# EAGLE design Mini-Lora (EAGLE 7.7.0)
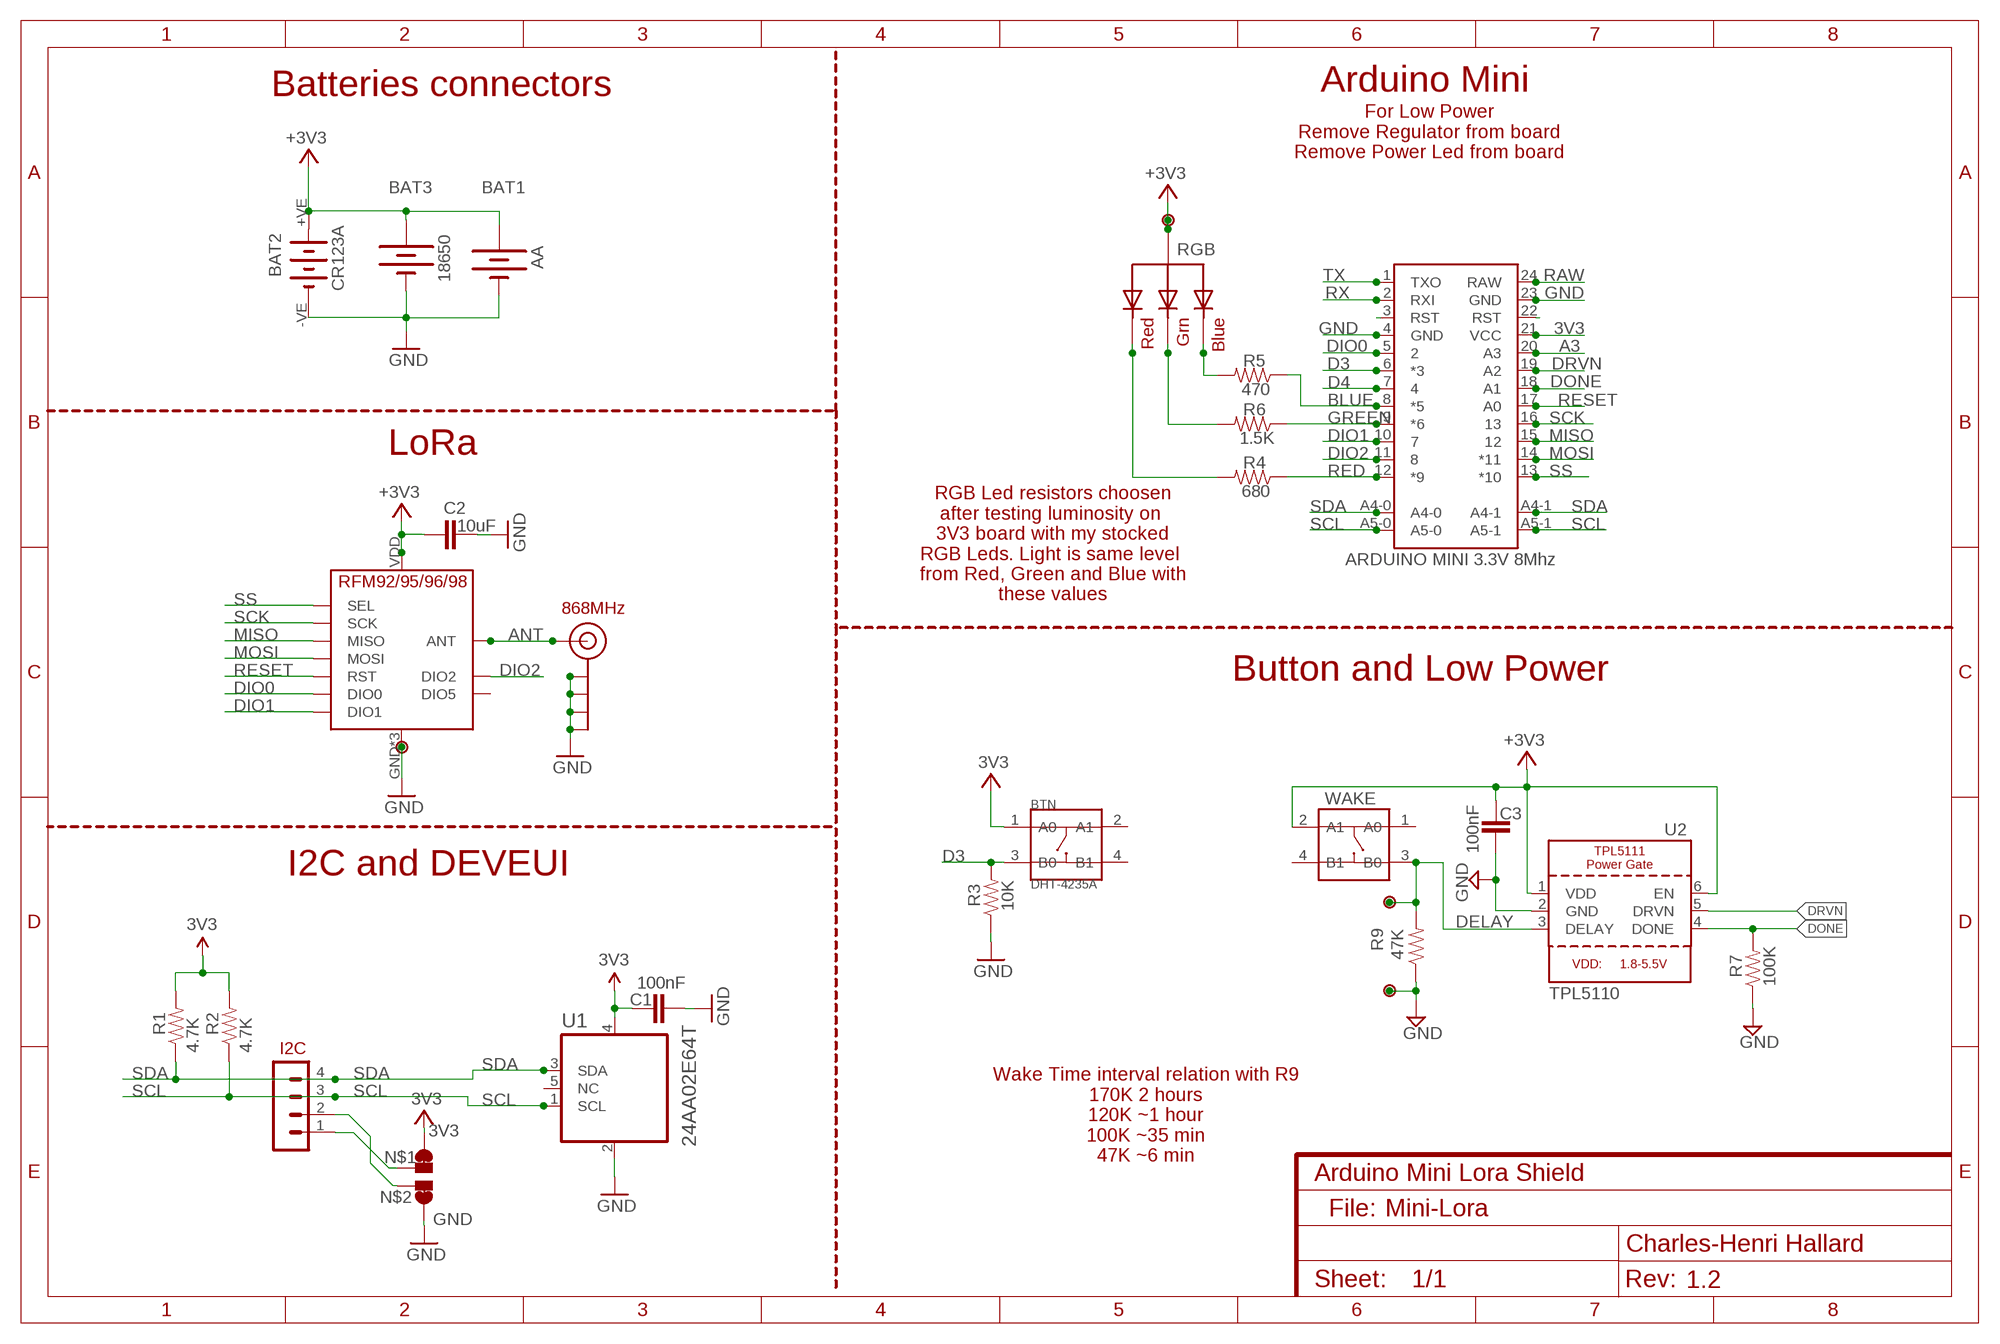
[diagram p0: schematic, sheet 1]
NAME (FRAME-A4L): CNAME: Arduino Mini Lora Shield; CREVISION: 1.2; DESIGNER: Charles-Henri Hallard

## Parts
BAT1  AA  BATTERYAA  [BATTERY-AA]
BAT2  CR123A  BATT-CR123A  [KEYSTONE-2/3A]
BAT3  18650  BATTERY18650  [BATTERY_18650-HOLDER]
BTN  DHT-4235A  SMD-BUTTON-TOP-DHT-4235A(4P-4.2X3.2MM)  [SW4-SMD-4.2X3.2X2.5MM]
C1  100nF  CAP0805-CAP  [0805-CAP]
C2  10uF  CAP0805-CAP-LARGEPADS  [0805-CAP-LARGEPADS]
C3  100nF  CAP0805-CAP  [0805-CAP]
I2C  CON_HEADER_1X04'NO_LOCK'  [1X04_NO_LOCK]
J$2  ANTENNATINY  [SMA_UFL_PAD_TINY]
P1  GND  PADNORMAL  [PAD]
P2  PADNORMAL  [PAD]
P3  PADNORMAL  [PAD]
P4  PADNORMAL  [PAD]
R1  4.7K  RESISTOR0805-RES  [0805-RES]
R2  4.7K  RESISTOR0805-RES  [0805-RES]
R3  10K  RESISTOR0805-RES  [0805-RES]
R4  680  RESISTOR0805-RES  [0805-RES]
R5  470  RESISTOR0805-RES  [0805-RES]
R6  1.5K  RESISTOR0805-RES  [0805-RES]
R7  100K  RESISTOR0805-RES  [0805-RES]
R9  47K  RESISTOR'1206-RES''  [1206-RES]
RGB  RGBLED  RGBLED_CASTRAIGHT  [LED5MMRGB_ST]
U1  24AA02E64T  24AA02E64T-I/OT  [SOT95P270X145-5N]
U2  TPL5110  TPL5111  [SOT23-6]
U$1  PAD-JUMPER-SWAPSWAP  [PAD-JUMPER-SWAP]
U$5  RFM95  [RFM95]
U$6  ARDUINO MINI 3.3V 8Mhz  ARDUINO_PRO_MINI  [ARDUINO_PRO_MINI]
WAKE  WAKE  SMD-BUTTON-TOP-DHT-4235A(4P-4.2X3.2MM)  [SW4-SMD-4.2X3.2X2.5MM]

## Nets
3V3: BAT1.PWR@1(+) BAT2.+VE(+) BAT3.PWR@1(+) BTN.1(A0) C1.1 C2.2 C3.1 P4.1 R1.2 R2.2 RGB.2(VCC) U1.4(VCC) U2.1(VDD) U2.6(EN) U$1.4 U$1.44 U$5.VDD(VCC) U$6.21(VCC) WAKE.2(A1) ; supply symbol labelled +3V3
A3: U$6.20(A3)
ANT: J$2.ANT1(SIGNAL) J$2.ANT2(SIGNAL) J$2.ANT3(SIGNAL) U$5.ANT
BLUE: R5.1 U$6.8(*5)
D3: BTN.3(B0) R3.2 U$6.6(*3)
D4: U$6.7
DELAY: P2.1 R9.2 U2.3(DELAY) WAKE.3(B0)
DIO0: U$5.DIO0 U$6.5
DIO1: U$5.DIO1 U$6.10
DIO2: U$5.DIO2 U$6.11
DONE: R7.2 U2.4(DONE) U$6.18(A1)
DRVN: U2.5(DRVN) U$6.19(A2)
GND: BAT1.GND@1(-) BAT2.-VE(-) BAT3.GND@1(-) C1.2 C2.1 C3.2 J$2.GND1(GND) J$2.GND2(GND) J$2.GND3(GND) J$2.GND4(GND) P1.1 P3.1 R3.1 R7.1 R9.1 U1.2(VSS) U2.2(GND) U$1.1 U$1.11 U$5.GND U$5.GND1(GND) U$5.GND2(GND) U$6.4(GND) U$6.23(GND)
GREEN: R6.1 U$6.9(*6)
LB: R5.2 RGB.4(BLUE)
LG: R6.2 RGB.3(GREEN)
LR: R4.2 RGB.1(RED)
MISO: U$5.MISO U$6.15
MOSI: U$5.MOSI U$6.14(*11)
N$1: I2C.1 U$1.3
N$2: I2C.2 U$1.2
N$3: U$6.3(RST)
RAW: U$6.24(RAW)
RED: R4.1 U$6.12(*9)
RESET: U$5.RST U$6.17(A0)
RST: U$6.22(RST)
RX: U$6.2(RXI)
SCK: U$5.SCK U$6.16
SCL: I2C.3 R2.1 U1.1(SCL) U$6.A5-0 U$6.A5-1
SDA: I2C.4 R1.1 U1.3(SDA) U$6.A4-0 U$6.A4-1
SS: U$5.NSS(SEL) U$6.13(*10)
TX: U$6.1(TXO)
Unconnected: BTN.2(A1) BTN.4(B1) U1.5(NC) U$5.DIO5 WAKE.1(A0) WAKE.4(B1)

## Notes on the sheet
- Batteries connectors | Arduino Mini
- For Low Power
  Remove Regulator from board
  Remove Power Led from board
- LoRa
- RGB Led resistors choosen
  after testing luminosity on 
  3V3 board with my stocked
  RGB Leds. Light is same level 
  from Red, Green and Blue with
  these values
- 868MHz
- Button and Low Power
- I2C and DEVEUI
- Wake Time interval relation with R9
  170K 2 hours
  120K ~1 hour
  100K ~35 min
  47K ~6 min
- File:

## Library data of the parts
BAT1 = JeeLabs.rpt:BATTERY: Battery Holders
BAT2 = edeca.net-v5:BATT-CR123A: CR123A (2/3rd AA) battery holder Manufacturer: Keystone Mouser part: 534-1019
BAT3 = _c2h:BATTERY: Battery Holders
BTN = Switch-2016:SMD-BUTTON-TOP-DHT-4235A(4P-4.2X3.2MM): 311020045; MPN: DHT-4235A
C1-C3 = _c2h:CAP: Capacitor Standard 0603 ceramic capacitor, and 0.1" leaded capacitor.
I2C = _c2h:CON_HEADER_1X04
J$2 = _c2h:ANTENNA: SMA Antenna Connector End launch SMA connector. The paste layer has been removed so that the connector can be hand soldered onto the board after reflow.
P1 P4 = _c2h:PAD
P2 P3 = _c2h-MacBook Pro de Charles-Henri:PAD
R1-R7 R9 = _c2h:RESISTOR: Resistor Basic schematic elements and footprints for 0603, 1206, and PTH resistors.
RGB = _c2h:RGBLED_CA: RGB LED, common-anode 5MM Staggered pins 5mm Piranha package http://www.ladyada.net/library/pcb/eaglelibrary.html
U1 = Microchip-24AA02E64T:24AA02E64T-I/OT: 2K I2C™ Serial EEPROMs, SOT23-5; MPN: 24AA02E64T-I/OT; OC_FARNELL: 2345567; OC_NEWARK: 01X0461; PACKAGE: SOT23-5; SUPPLIER: Microchip
U2 = microbuilder:TPL5111: TPL5111 Timer Based Power Gate Selectable Time Intervals: 100 ms to 7200 s Current Consumption at 2.5 V: 35 nA (typical) Supply Voltage Range: 1.8 V to 5.5 V
U$1 = _c2h:PAD-JUMPER-SWAP
U$5 = _c2h:RFM95
U$6 = _c2h:ARDUINO_PRO_MINI
WAKE = Switch-2016:SMD-BUTTON-TOP-DHT-4235A(4P-4.2X3.2MM): 311020045; MPN: DHT-4235A; VALUE: DHT-4235A

## Net classes
0 default: width 0.203 mm, drill 0.356 mm, clearance 0.152 mm
1 power: width 0.203 mm, clearance 0.152 mm
2 GND: width 0.203 mm, drill 0.305 mm, clearance 0.152 mm

## Board
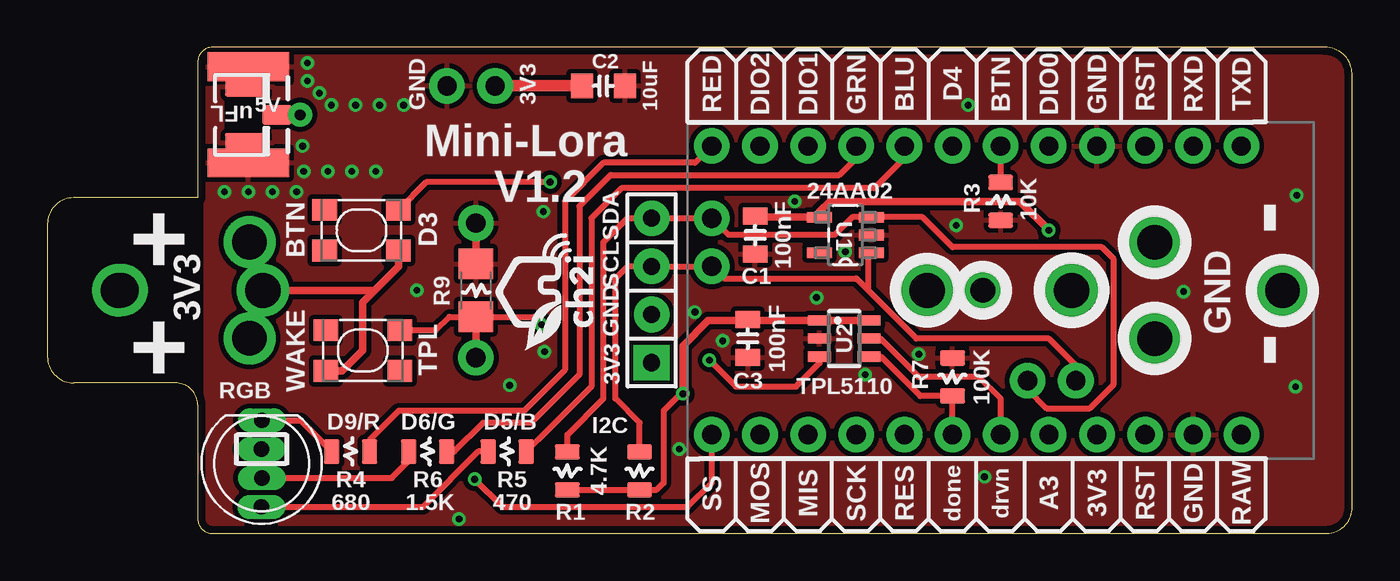
[diagram p1: board, top side]
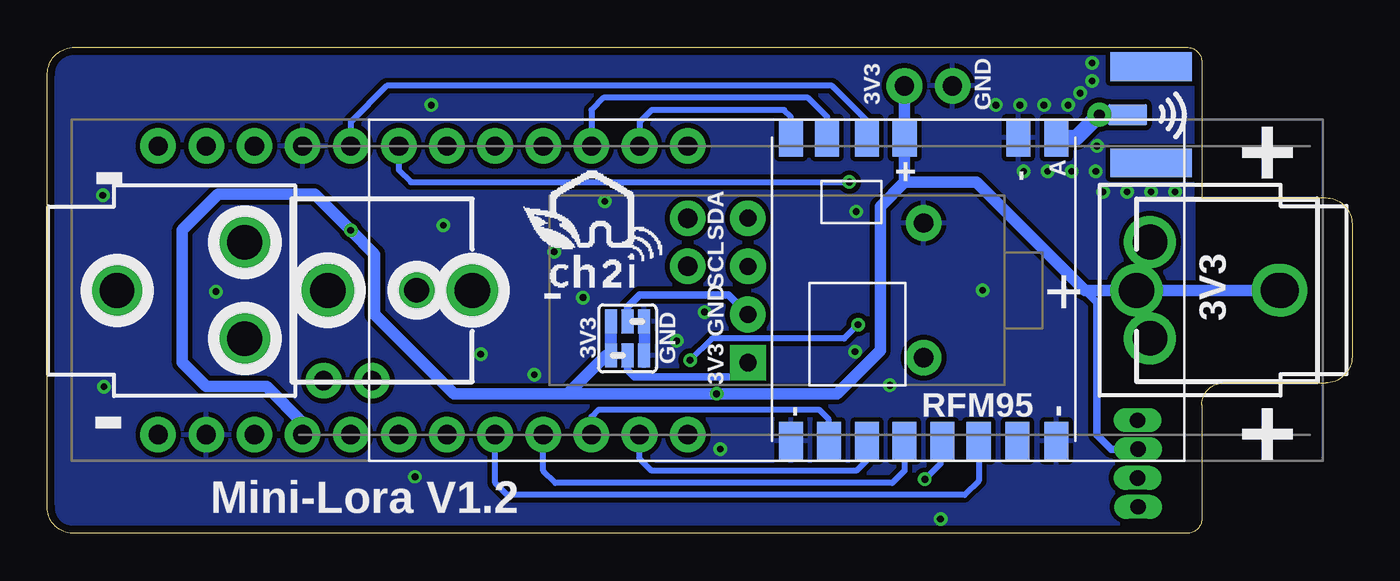
[diagram p2: board, bottom side, seen from below]

Size 68.83 x 25.65 mm. Coordinates in mm from the lower left corner, seen from the top.
Outline: 67.41,25.65 8.7,25.65 arc90 7.94,24.89 7.94,17.72 1.4,17.72 arc90 0,16.32 0,9.33 arc90 1.4,7.94 6.73,7.94 arc-90 7.94,6.79 7.94,0.76 arc90 8.7,0 67.5,0 arc90 68.83,1.4 68.83,24.26 arc90 67.41,25.65
Copper layers (1*16): Top 0.0356mm / dielectric 1.5011mm / Bottom 0.0356mm
Design rules "PCBs_io": minimum track width 6mil, minimum drill 13mil, track to track 6mil, track to pad 6mil, pad to pad 6mil, via to via 6mil, smd to smd 6mil, copper to edge 15mil, drill to drill 6mil, minimum pad ring 7mil, minimum via ring 7mil, stop-mask expansion 3mil, vias tented up to drill 40mil, thermal gap 10mil

### Footprints (pad centres in the part's own frame; a part is rotated, then mirrored left to right if it is on the bottom)
BATTERY-AA = drill 1.854: GND@1 25.146,0; GND@2 17.526,0; PWR@1 -25.146,0; PWR@2 -17.526,0
KEYSTONE-2/3A = drill 1.3: +VE 0,19; -VE 0,-19
BATTERY_18650-HOLDER = drill 1.829: GND@1 30.628,0.01; GND@2 23.88,2.55; GND@3 23.88,-2.53; PWR@1 -30.628,-0.01; PWR@2 -23.88,2.53; PWR@3 -23.88,-2.55
SW4-SMD-4.2X3.2X2.5MM = smd 1.3 x 1.15: 1 -1.95,1.075; 2 1.95,1.075; 3 -1.95,-1.075; 4 1.95,-1.075
0805-CAP = smd 0.902 x 1.3: 1 -1,0; 2 1,0
0805-CAP-LARGEPADS = smd 1.156 x 1.3: 1 -1.127,0; 2 1.127,0
1X04_NO_LOCK = drill 0.9 pad 1.88 square: 1 -3.816,-0.121 | drill 0.9 pad 1.88: 2 -1.27,-0.133; 3 1.27,-0.121; 4 3.81,-0.133
SMA_UFL_PAD_TINY = smd 1.524 x 1.016: ANT1 -3.843,0 | drill 0.559 pad 1.27: ANT2 -5.08,0 | smd 2.032 x 1.143 bottom: ANT3 -3.589,0 | smd 2.2 x 1.016: GND1 -2.223,1.47; GND2 -2.223,-1.47 | smd 4.318 x 1.524: GND3 -2.349,-2.54; GND4 -2.349,2.54 | smd 4.318 x 1.524 bottom: GND5 -2.349,2.54; GND6 -2.349,-2.54
PAD = drill 1.016 pad 1.88: 1 0,0
0805-RES = smd 0.8 x 1.3: 1 -1,0; 2 1,0
1206-RES = smd 1.6 x 1.8: 1 -1.4,0; 2 1.4,0
LED5MMRGB_ST = drill 0.8 pad 1.27 long: 1 -2.286,0.016; 2 -0.762,-0.016; 3 0.762,0.016; 4 2.286,-0.016
SOT95P270X145-5N = smd 1.321 x 0.559: 1 -1.372,0.94; 2 -1.372,0; 3 -1.372,-0.94; 4 1.372,-0.94; 5 1.372,0.94
SOT23-6 = smd 0.55 x 1.2: 1 -0.95,-1.3; 2 0,-1.3; 3 0.95,-1.3; 4 0.95,1.3; 5 0,1.3; 6 -0.95,1.3
PAD-JUMPER-SWAP = smd 0.635 x 1.27: 1 -0.876,0.889; 2 0,-0.889; 3 0,0.889; 4 0.876,-0.889; 11 -0.876,-0.889; 44 0.876,0.889
RFM95 = smd 2 x 1.27: ANT 5.777,-7; DIO0 5.777,3; DIO1 5.779,5.095; DIO2 5.779,7; DIO5 -10.225,-4.936; GND 5.777,-5; GND1 -10.223,7; GND2 -10.23,-7; MISO -10.23,5; MOSI -10.225,3; NSS -10.223,-1; RST -10.223,-2.905; SCK -10.23,1.012; VDD 5.777,1
ARDUINO_PRO_MINI = drill 1.016 pad 1.88: 1 -7.62,12.7; 2 -7.62,10.16; 3 -7.62,7.62; 4 -7.62,5.08; 5 -7.62,2.54; 6 -7.62,0; 7 -7.62,-2.54; 8 -7.62,-5.08; 9 -7.62,-7.62; 10 -7.62,-10.16; 11 -7.62,-12.7; 12 -7.62,-15.24; 13 7.62,-15.24; 14 7.62,-12.7; 15 7.62,-10.16; 16 7.62,-7.62; 17 7.62,-5.08; 18 7.62,-2.54; 19 7.62,0; 20 7.62,2.54; 21 7.62,5.08; 22 7.62,7.62; 23 7.62,10.16; 24 7.62,12.7; A4-0 -3.81,-15.24; A4-1 4.763,1.429; A5-0 -1.27,-15.24; A5-1 4.763,3.969

### Placement (x,y rotation side)
BAT1  28.89,12.83 180 bottom
BAT2  30.35,12.83 270 bottom
BAT3  34.54,12.83 180 bottom
BTN  16.57,16 180 top
C1  37.34,15.75 270 top
C2  29.34,23.62 180 top
C3  36.96,10.29 270 top
I2C  31.75,12.83 90 top
J$2  8.25,22.1 180 top
P1  21.08,23.62 0 top
P2  22.61,9.27 0 top
P3  22.61,16.38 0 top
P4  23.62,23.62 0 top
R1  27.43,3.3 270 top
R2  31.24,3.3 270 top
R3  50.29,17.53 90 top
R4  16,4.32 180 top
R5  24.26,4.32 180 top
R6  20.07,4.32 180 top
R7  47.75,8.26 270 top
R9  22.61,12.83 270 top
RGB  11.3,3.68 270 top
U1  42.1,15.75 180 top
U2  42.04,10.29 270 top
U$1  38.23,10.29 180 bottom
U$2  [LOGO_C2I_015]  28.83,9.65 90 top
U$4  [LOGO_CH2I_75MM]  39.62,14.99 0 bottom
U$5  22.61,15.11 90 bottom
U$6  50.29,12.83 270 top
WAKE  16.64,9.65 180 top

### Tracks (layer width: path | path; a pad name or v marks a point on that pad's centre or on a via)
3V3  (via drill 0.36 pad 0.71)
  Top 0.305: R1.2 R2.2 32.15,2.3 32.51,2.67 32.51,6.48 33.4,7.37
  Top 0.406: 37.64,11.24 U2.1 U2.6 | 37.64,11.24 C3.1 | 37.64,11.24 34.86,11.24 33.53,9.91 v33.53,7.37 33.4,7.37 | v52.83,16 51.31,17.53 41.27,17.53 40.73,16.98 U1.4 37.4,16.69 C1.1 | WAKE.2 15.56,8.58 16.64,9.65 16.64,12.19 17.27,12.83 | BTN.1 18.52,14.08 17.27,12.83 | 17.27,12.83 BAT2.+VE
  Top 0.61: C2.2 P4.1
  Bottom 0.406: 55.37,5.52 U$6.21 | RGB.2 12.7,4.44 13.46,5.21 13.46,12.19 14.1,12.83
  Bottom 0.61: 55.37,5.52 55.37,5.84 57.28,7.75 60.45,7.75 61.72,9.02 61.72,16 59.82,17.91 54.74,17.91 v52.83,16 51.56,14.73 51.56,11.56 47.37,7.37 41.4,7.37 | 3.8,12.83 BAT3.PWR@1 | 41.4,7.37 v33.53,7.37 27.18,7.37 24.89,9.65 24.89,17.26 23.61,18.54 | U$1.4 U$1.44 39.37,9.4 41.4,7.37 | 23.61,18.54 U$5.VDD 23.61,23.61 P4.1 | 3.8,12.83 BAT2.+VE 14.1,12.83 19.81,18.54 23.61,18.54 | 3.8,12.83 BAT1.PWR@1
ANT
  Top 0.61: J$2.ANT1 J$2.ANT2
  Bottom 0.61: J$2.ANT3 J$2.ANT2
  Bottom 0.813: U$5.ANT 14.54,20.89 J$2.ANT2
BLUE
  Top 0.305: U$6.8 45.21,19.81 43.62,18.22 30.29,18.22 28.7,16.64 28.7,7.75 25.89,4.94 R5.1
D3  (via drill 0.36 pad 0.71)
  Top 0.305: v26.52,18.54 26.39,18.54 19.99,18.54 BTN.3 18.54,17.09 | R3.2 U$6.6
  Bottom 0.305: U$6.6 50.29,19.18 49.66,18.54 29.82,18.54 v26.52,18.54
DELAY  (via drill 0.36 pad 0.71)
  Top 0.305: WAKE.3 20.51,10.73 21.21,11.43 22.98,11.43 R9.2 25.66,11.43 v26.07,11.02 | v34.92,9.14 36.32,7.75 39.5,7.75 40.74,8.99 U2.3
  Top 0.406: P2.1 R9.2
  Bottom 0.305: v26.07,11.02 26.8,10.29 33.78,10.29 v34.92,9.14
DIO0
  Bottom 0.305: U$5.DIO0 25.61,21.8 27.43,23.62 50.93,23.62 52.83,21.72 U$6.5
DIO1
  Bottom 0.305: U$5.DIO1 27.7,21.99 28.7,22.99 39.5,22.99 40.13,22.35 U$6.10
DIO2
  Bottom 0.305: U$5.DIO2 29.61,21.99 29.97,22.35 36.96,22.35 37.59,21.72 U$6.11
DONE
  Top 0.305: U$6.18 R7.2 46.05,7.25 43.97,9.34 U2.4
DRVN
  Top 0.305: U2.5 43.94,10.29 45.97,8.26 49.15,8.26 50.29,7.11 U$6.19
GND  (via drill 0.36 pad 0.71)
  Top 0.406: R9.1 P3.1
  Bottom 0.305: U$1.1 U$1.11
  other vias: 21.72,0.76 65.91,17.84 65.85,7.75 19.49,12.83 26.16,16.99 59.94,12.76 49.43,2.98 26.23,9.59 16.26,22.61 14.99,22.61 14.35,23.24 13.72,23.88 13.72,24.83 13.46,20.45 10.6,18.03 11.87,18.03 13.14,18.03 9.33,18.03 13.53,19.11 17.53,22.61 18.8,22.61 14.8,19.11 16.07,19.11 17.34,19.11 24.38,7.81 34.16,11.68 47.94,16.26 39.43,17.53 48.58,22.61 45.97,9.46 42.1,14.86 35.62,10.16 33.34,4.44 40.58,12.45 43.15,8.38
  pour Bottom (isolate 0.254): 69.98,26.8 69.98,-1.14 8.38,-1.14 8.38,26.8
  pour Top (isolate 0.254): 8.38,26.16 69.34,26.16 69.34,-0.51 8.38,-0.51
GREEN
  Top 0.305: U$6.9 42.67,19.81 41.78,18.92 29.72,18.92 28.07,17.27 28.07,8.38 25.53,5.84 22.99,5.84 21.46,4.32 R6.1
LB
  Top 0.305: RGB.4 19.81,1.4 22.73,4.32 R5.2
LG
  Top 0.305: RGB.3 18.16,2.92 19.07,3.83 R6.2
LR
  Top 0.305: RGB.1 13.35,5.97 R4.2
MISO
  Bottom 0.305: U$6.15 40.13,6.16 39.75,6.54 28.13,6.54 27.61,6.02 U$5.MISO
MOSI
  Bottom 0.305: U$5.MOSI 25.61,3.86 26.16,3.3 36.96,3.3 37.59,3.94 U$6.14
N$1
  Bottom 0.406: U$1.3 38.23,8.64 37.85,8.26 32.63,8.26 I2C.1
N$2
  Bottom 0.406: U$1.2 38.23,11.94 37.59,12.57 32.9,12.57 I2C.2
RED
  Top 0.305: U$6.12 34.16,19.56 29.34,19.56 27.3,17.53 27.3,8.64 25.15,6.48 18.54,6.48 17,4.94 R4.1
RESET
  Bottom 0.305: U$5.RST 19.7,2.78 20.45,2.03 44.58,2.03 45.21,2.67 U$6.17
SCK
  Bottom 0.305: U$5.SCK 23.62,3.31 24.26,2.67 42.04,2.67 42.67,3.3 U$6.16
SCL
  Top 0.305: U$6.A5-1 54.26,8.86 52.83,10.29 45.85,10.29 43.31,12.83 | R2.1 31.24,5.84 29.97,7.11 29.97,13.46 30.61,14.1 I2C.3 U$6.A5-0 35.69,13.46 42.67,13.46 43.31,12.83 | 43.31,12.83 43.31,14.64 U1.1
SDA
  Top 0.305: I2C.4 32.11,16.64 | I2C.4 U$6.A4-0 35.94,15.75 41.53,15.75 42.47,16.69 U1.3 46.18,16.69 47.75,15.11 55.63,15.11 56.26,14.48 56.26,7.87 54.99,6.6 52.7,6.6 51.72,7.59 U$6.A4-1 | R1.1 27.43,5.21 29.34,7.11 29.34,15.37 30.61,16.64 I2C.4
SS  (via drill 0.36 pad 0.71)
  Top 0.305: v22.54,2.86 24,1.4 33.78,1.4 35.05,2.67 U$6.13
  Bottom 0.305: U$5.NSS 21.72,5 21.72,3.68 v22.54,2.86

### Text on the board
tNames: GND | 3V3 | RED | DIO2 | DIO1 | GRN | BLU | D4 | BTN | DIO0 | GND | RST | RXD | TXD | 5V | Mini-Lora | V1.2 | 24AA02 | - | BTN | D3 | + | SDA | 3V3 | SCL | GND | + | TPL | GND | - | 3V3 | D9/R | D6/G | D5/B | I2C | SS | MOS | MIS | SCK | RES | done | drvn | A3 | 3V3 | RST | GND | RAW
bNames: GND | 3V3 | + | - | SDA | 3V3 | SCL | GND | GND | 3V3 | 3V3 | RFM95 | - | + | Mini-Lora V1.2